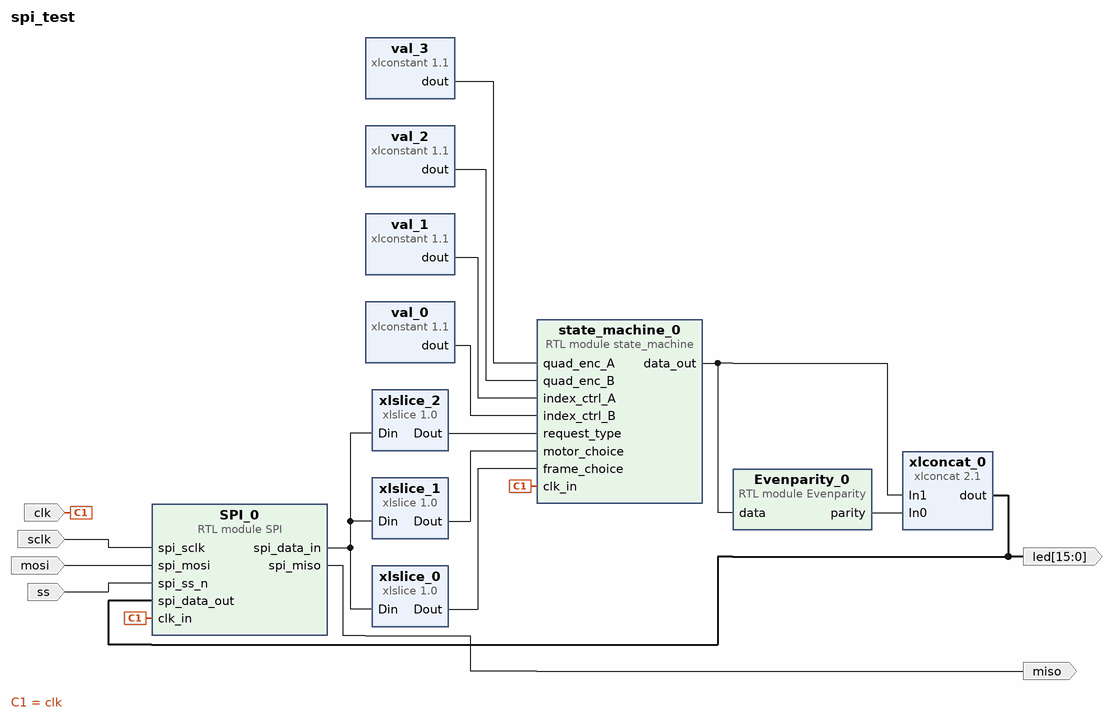
[diagram p0: block diagram of the top level]
# Vivado block design spi_test, xc7a35tcpg236-1, Vivado 2019.2
create_bd_design spi_test

create_bd_port -dir I clk
create_bd_port -dir I sclk
create_bd_port -dir I mosi
create_bd_port -dir I ss
create_bd_port -dir O miso
create_bd_port -dir O -from 15 -to 0 led

create_bd_cell -type module -reference SPI SPI_0
create_bd_cell -type module -reference state_machine state_machine_0
create_bd_cell -type ip -vlnv xilinx.com:ip:xlconcat:2.1 xlconcat_0
set_property -dict {CONFIG.IN0_WIDTH 1 CONFIG.IN1_WIDTH 15} [get_bd_cells xlconcat_0]
create_bd_cell -type ip -vlnv xilinx.com:ip:xlslice:1.0 xlslice_0
set_property -dict {CONFIG.DIN_FROM 15 CONFIG.DIN_TO 15 CONFIG.DIN_WIDTH 16} [get_bd_cells xlslice_0]
create_bd_cell -type ip -vlnv xilinx.com:ip:xlslice:1.0 xlslice_1
set_property -dict {CONFIG.DIN_FROM 14 CONFIG.DIN_TO 14 CONFIG.DIN_WIDTH 16} [get_bd_cells xlslice_1]
create_bd_cell -type ip -vlnv xilinx.com:ip:xlslice:1.0 xlslice_2
set_property -dict {CONFIG.DIN_FROM 13 CONFIG.DIN_TO 13 CONFIG.DIN_WIDTH 16} [get_bd_cells xlslice_2]
create_bd_cell -type ip -vlnv xilinx.com:ip:xlconstant:1.1 val_3
set_property -dict {CONFIG.CONST_VAL 3 CONFIG.CONST_WIDTH 15} [get_bd_cells val_3]
create_bd_cell -type ip -vlnv xilinx.com:ip:xlconstant:1.1 val_2
set_property -dict {CONFIG.CONST_VAL 2 CONFIG.CONST_WIDTH 15} [get_bd_cells val_2]
create_bd_cell -type ip -vlnv xilinx.com:ip:xlconstant:1.1 val_1
set_property -dict {CONFIG.CONST_VAL 1 CONFIG.CONST_WIDTH 1} [get_bd_cells val_1]
create_bd_cell -type ip -vlnv xilinx.com:ip:xlconstant:1.1 val_0
set_property -dict {CONFIG.CONST_VAL 0 CONFIG.CONST_WIDTH 1} [get_bd_cells val_0]
create_bd_cell -type module -reference Evenparity Evenparity_0

# ---- connections ----

connect_bd_net -net clk_in_0_1 [get_bd_ports clk] [get_bd_pins SPI_0/clk_in] [get_bd_pins state_machine_0/clk_in]
connect_bd_net -net spi_sclk_0_1 [get_bd_ports sclk] [get_bd_pins SPI_0/spi_sclk]
connect_bd_net -net spi_mosi_0_1 [get_bd_ports mosi] [get_bd_pins SPI_0/spi_mosi]
connect_bd_net -net spi_ss_n_0_1 [get_bd_ports ss] [get_bd_pins SPI_0/spi_ss_n]
connect_bd_net [get_bd_pins SPI_0/spi_miso] [get_bd_ports miso]
connect_bd_net [get_bd_pins state_machine_0/data_out] [get_bd_pins Evenparity_0/data] [get_bd_pins xlconcat_0/In1]
connect_bd_net [get_bd_pins SPI_0/spi_data_in] [get_bd_pins xlslice_0/Din] [get_bd_pins xlslice_1/Din] [get_bd_pins xlslice_2/Din]
connect_bd_net [get_bd_pins xlslice_0/Dout] [get_bd_pins state_machine_0/frame_choice]
connect_bd_net [get_bd_pins xlslice_1/Dout] [get_bd_pins state_machine_0/motor_choice]
connect_bd_net [get_bd_pins xlslice_2/Dout] [get_bd_pins state_machine_0/request_type]
connect_bd_net -net xlconstant_0_dout [get_bd_pins val_3/dout] [get_bd_pins state_machine_0/quad_enc_A]
connect_bd_net -net val_0x0A0A1_dout [get_bd_pins val_2/dout] [get_bd_pins state_machine_0/quad_enc_B]
connect_bd_net -net val_0x0A0A2_dout [get_bd_pins val_1/dout] [get_bd_pins state_machine_0/index_ctrl_A]
connect_bd_net -net val_0x0A0A3_dout [get_bd_pins val_0/dout] [get_bd_pins state_machine_0/index_ctrl_B]
connect_bd_net [get_bd_pins xlconcat_0/dout] [get_bd_ports led] [get_bd_pins SPI_0/spi_data_out]
connect_bd_net [get_bd_pins Evenparity_0/parity] [get_bd_pins xlconcat_0/In0]

validate_bd_design
save_bd_design
